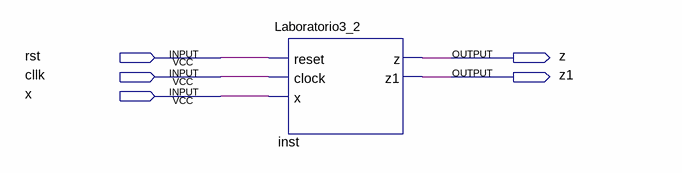
[diagram p0: schematic sheet]
// Quartus schematic bloque_fsm.bdf as structural Verilog: 1 symbols, 5 pins
module bloque_fsm (
  input  rst,
  input  cllk,
  input  x,
  output z,
  output z1
);

  Laboratorio3_2 inst (.reset(rst), .clock(cllk), .x(x), .z(z), .z1(z1));
endmodule
